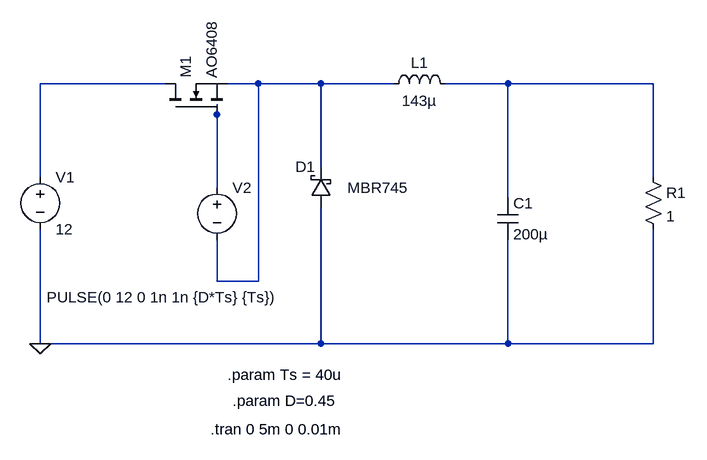
[diagram p0: schematic Switching Regulator.asc]
Switching Regulator.asc, the LTspice schematic file:
Version 4
SHEET 1 1112 680
WIRE -128 -48 -320 -48
WIRE 16 -48 -32 -48
WIRE 112 -48 16 -48
WIRE 224 -48 112 -48
WIRE 400 -48 304 -48
WIRE 624 -48 400 -48
WIRE -48 0 -48 -16
WIRE 112 80 112 -48
WIRE -320 96 -320 -48
WIRE 624 96 624 -48
WIRE -48 112 -48 0
WIRE 400 128 400 -48
WIRE -48 256 -48 192
WIRE 16 256 16 -48
WIRE 16 256 -48 256
WIRE -320 352 -320 176
WIRE 112 352 112 144
WIRE 112 352 -320 352
WIRE 400 352 400 192
WIRE 400 352 112 352
WIRE 624 352 624 176
WIRE 624 352 400 352
FLAG -320 352 0
SYMBOL voltage -320 80 R0
WINDOW 123 0 0 Left 0
WINDOW 39 0 0 Left 0
SYMATTR InstName V1
SYMATTR Value 12
SYMBOL voltage -48 96 R0
WINDOW 3 -262 185 Left 2
WINDOW 123 0 0 Left 0
WINDOW 39 0 0 Left 0
SYMATTR InstName V2
SYMATTR Value PULSE(0 12 0 1n 1n {D*Ts} {Ts})
SYMBOL nmos -128 0 R270
SYMATTR InstName M1
SYMATTR Value AO6408
SYMBOL schottky 128 144 R180
WINDOW 0 24 64 Left 2
WINDOW 3 -119 32 Left 2
SYMATTR InstName D1
SYMATTR Value MBR745
SYMATTR Description Diode
SYMATTR Type diode
SYMBOL ind 208 -32 R270
WINDOW 0 32 56 VTop 2
WINDOW 3 5 56 VBottom 2
SYMATTR InstName L1
SYMATTR Value 143µ
SYMBOL cap 384 128 R0
SYMATTR InstName C1
SYMATTR Value 200µ
SYMBOL res 608 80 R0
SYMATTR InstName R1
SYMATTR Value 1
TEXT -32 400 Left 2 !.param Ts = 40u
TEXT -24 440 Left 2 !.param D=0.45
TEXT -58 484 Left 2 !.tran 0 5m 0 0.01m

The netlist it stands for:
* Switching Regulator.asc
V1 N001 0 12
V2 N004 N002 PULSE(0 12 0 1n 1n {D*Ts} {Ts})
M1 N001 N004 N002 N002 AO6408
D1 0 N002 MBR745
L1 N002 N003 143µ
C1 N003 0 200µ
R1 N003 0 1
.model D D
.lib standard.dio
.model NMOS NMOS
.model PMOS PMOS
.lib standard.mos
.param Ts = 40u
.param D=0.45
.tran 0 5m 0 0.01m
.backanno
.end